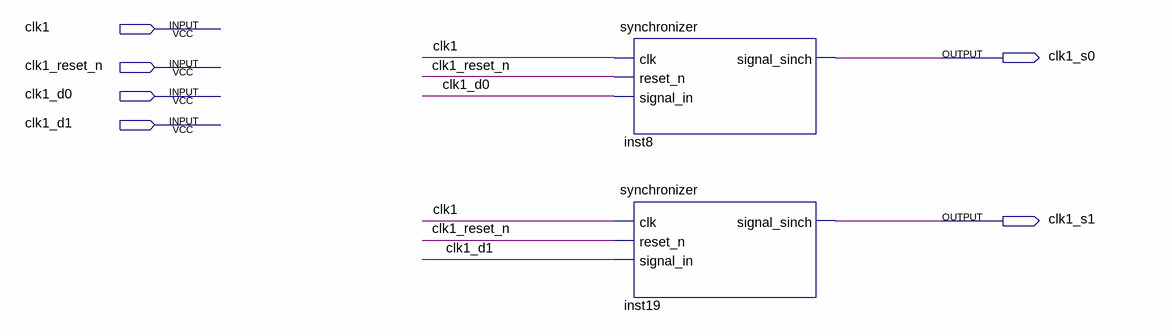
[diagram p0: schematic sheet]
// Quartus schematic rx_synchronizers.bdf as structural Verilog: 2 symbols, 6 pins
module rx_synchronizers (
  input  clk1,
  input  clk1_reset_n,
  input  clk1_d0,
  input  clk1_d1,
  output clk1_s0,
  output clk1_s1
);

  synchronizer inst8 (.clk(clk1), .reset_n(clk1_reset_n), .signal_in(clk1_d0), .signal_sinch(clk1_s0));
  synchronizer inst19 (.clk(clk1), .reset_n(clk1_reset_n), .signal_in(clk1_d1), .signal_sinch(clk1_s1));
endmodule
